# Altium schematic sheet Sheet1.SCHDOC
size 279 x 215 mm; SheetNumber: 1; SheetTotal: 1; DocumentName: Sheet1.SCHDOC
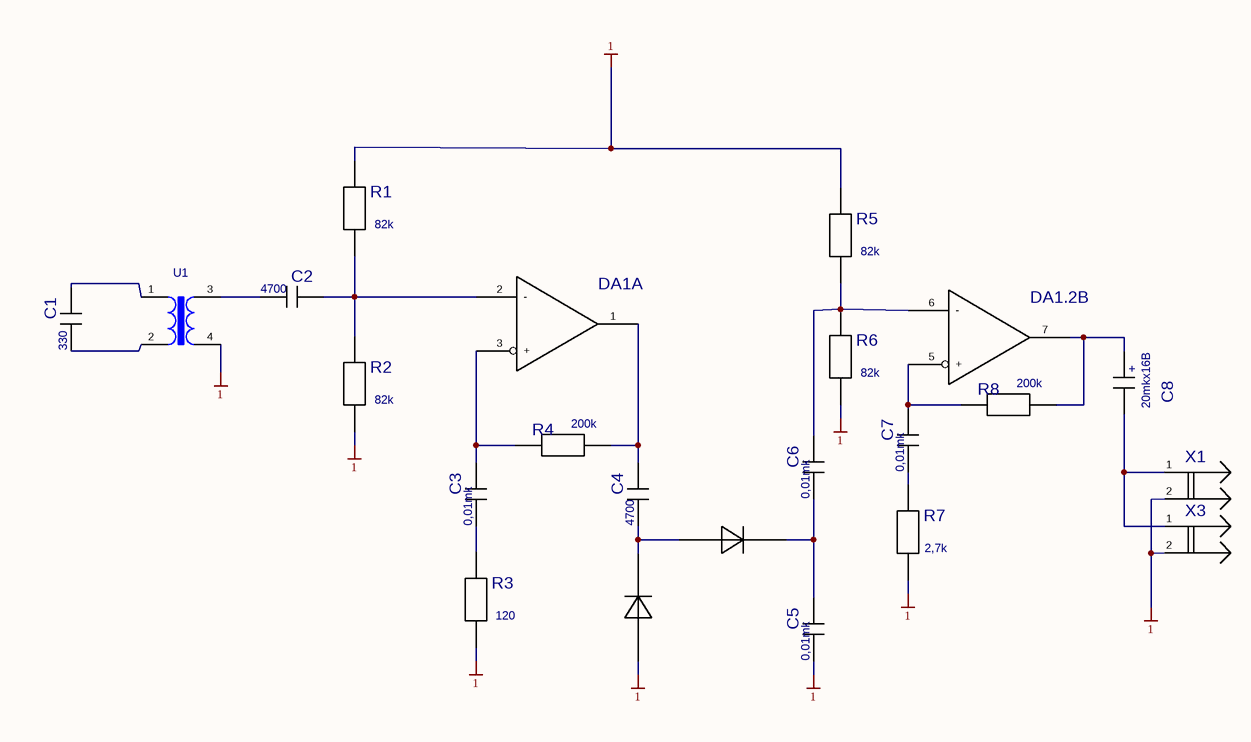
[diagram p0: Sheet1.SCHDOC]

## Parts
C1  value 330  [CAP1]  (hidden comment: CAP1)
C2  value 4700  [CAP1]  (hidden comment: CAP1)
C3  value 0,01mk  [CAP1]  (hidden comment: CAP1)
C4  value 4700  [CAP1]  (hidden comment: CAP1)
C5  value 0,01mk  [CAP1]  (hidden comment: CAP1)
C6  value 0,01mk  [CAP1]  (hidden comment: CAP1)
C7  value 0,01mk  [CAP1]  (hidden comment: CAP1)
C8  value 20mkx16B  [CAP2]  (hidden comment: CAP2)
DA1  LM358  (value not drawn)  (part A of 2)
DA1.2  LM358  (value not drawn)  (part B of 2)
R1  value 82k  [RES]  (hidden comment: RES)
R2  value 82k  [RES]  (hidden comment: RES)
R3  value 120  [RES]  (hidden comment: RES)
R4  value 200k  [RES]  (hidden comment: RES)
R5  value 82k  [RES]  (hidden comment: RES)
R6  value 82k  [RES]  (hidden comment: RES)
R7  value 2,7k  [RES]  (hidden comment: RES)
R8  value 200k  [RES]  (hidden comment: RES)
U1  TR  (value not drawn)
VD1  КД209  [DO-7]  (value not drawn)
VD2  КД209  [DO-7]  (value not drawn)
X1  2XR  [2XR]  (value not drawn)
X3  2XR  [2XR]  (value not drawn)

## Nets
1: C5.1 R1.2 R2.1 R3.1 R5.2 R6.1 R7.1 U1.4 VD1.2(A) X1.2(I/O2) X3.2(I/O2)
GND: DA1.4(GND) DA1.2.4(GND)
VCC: DA1.8(VCC) DA1.2.8(VCC)
NetC1_1: C1.1 U1.2
NetC1_2: C1.2 U1.1
NetC2_1: C2.1 U1.3
NetC2_2: C2.2 DA1.2(-) R1.1 R2.2
NetC3_1: C3.1 R3.2
NetC3_2: C3.2 DA1.3(+) R4.2
NetC4_1: C4.1 VD1.1(K) VD2.2(A)
NetC4_2: C4.2 DA1.1(OUT) R4.1
NetC5_2: C5.2 C6.1 VD2.1(K)
NetC6_2: C6.2 DA1.2.6(-) R5.1 R6.2
NetC7_1: C7.1 R7.2
NetC7_2: C7.2 DA1.2.5(+) R8.2
NetC8_1: C8.1 DA1.2.7(OUT) R8.1
NetC8_2: C8.2 X1.1(I/O1) X3.1(I/O1)

## Notes on the sheet
- (in symbol CAP2) +

## Library data of the parts
DA1.2 = LM358_VARIANT_1
U1 = TR: Value: *
X1 X3 = 2XR: Value: *